# Altium project DC_Handle_Master.PrjPcb
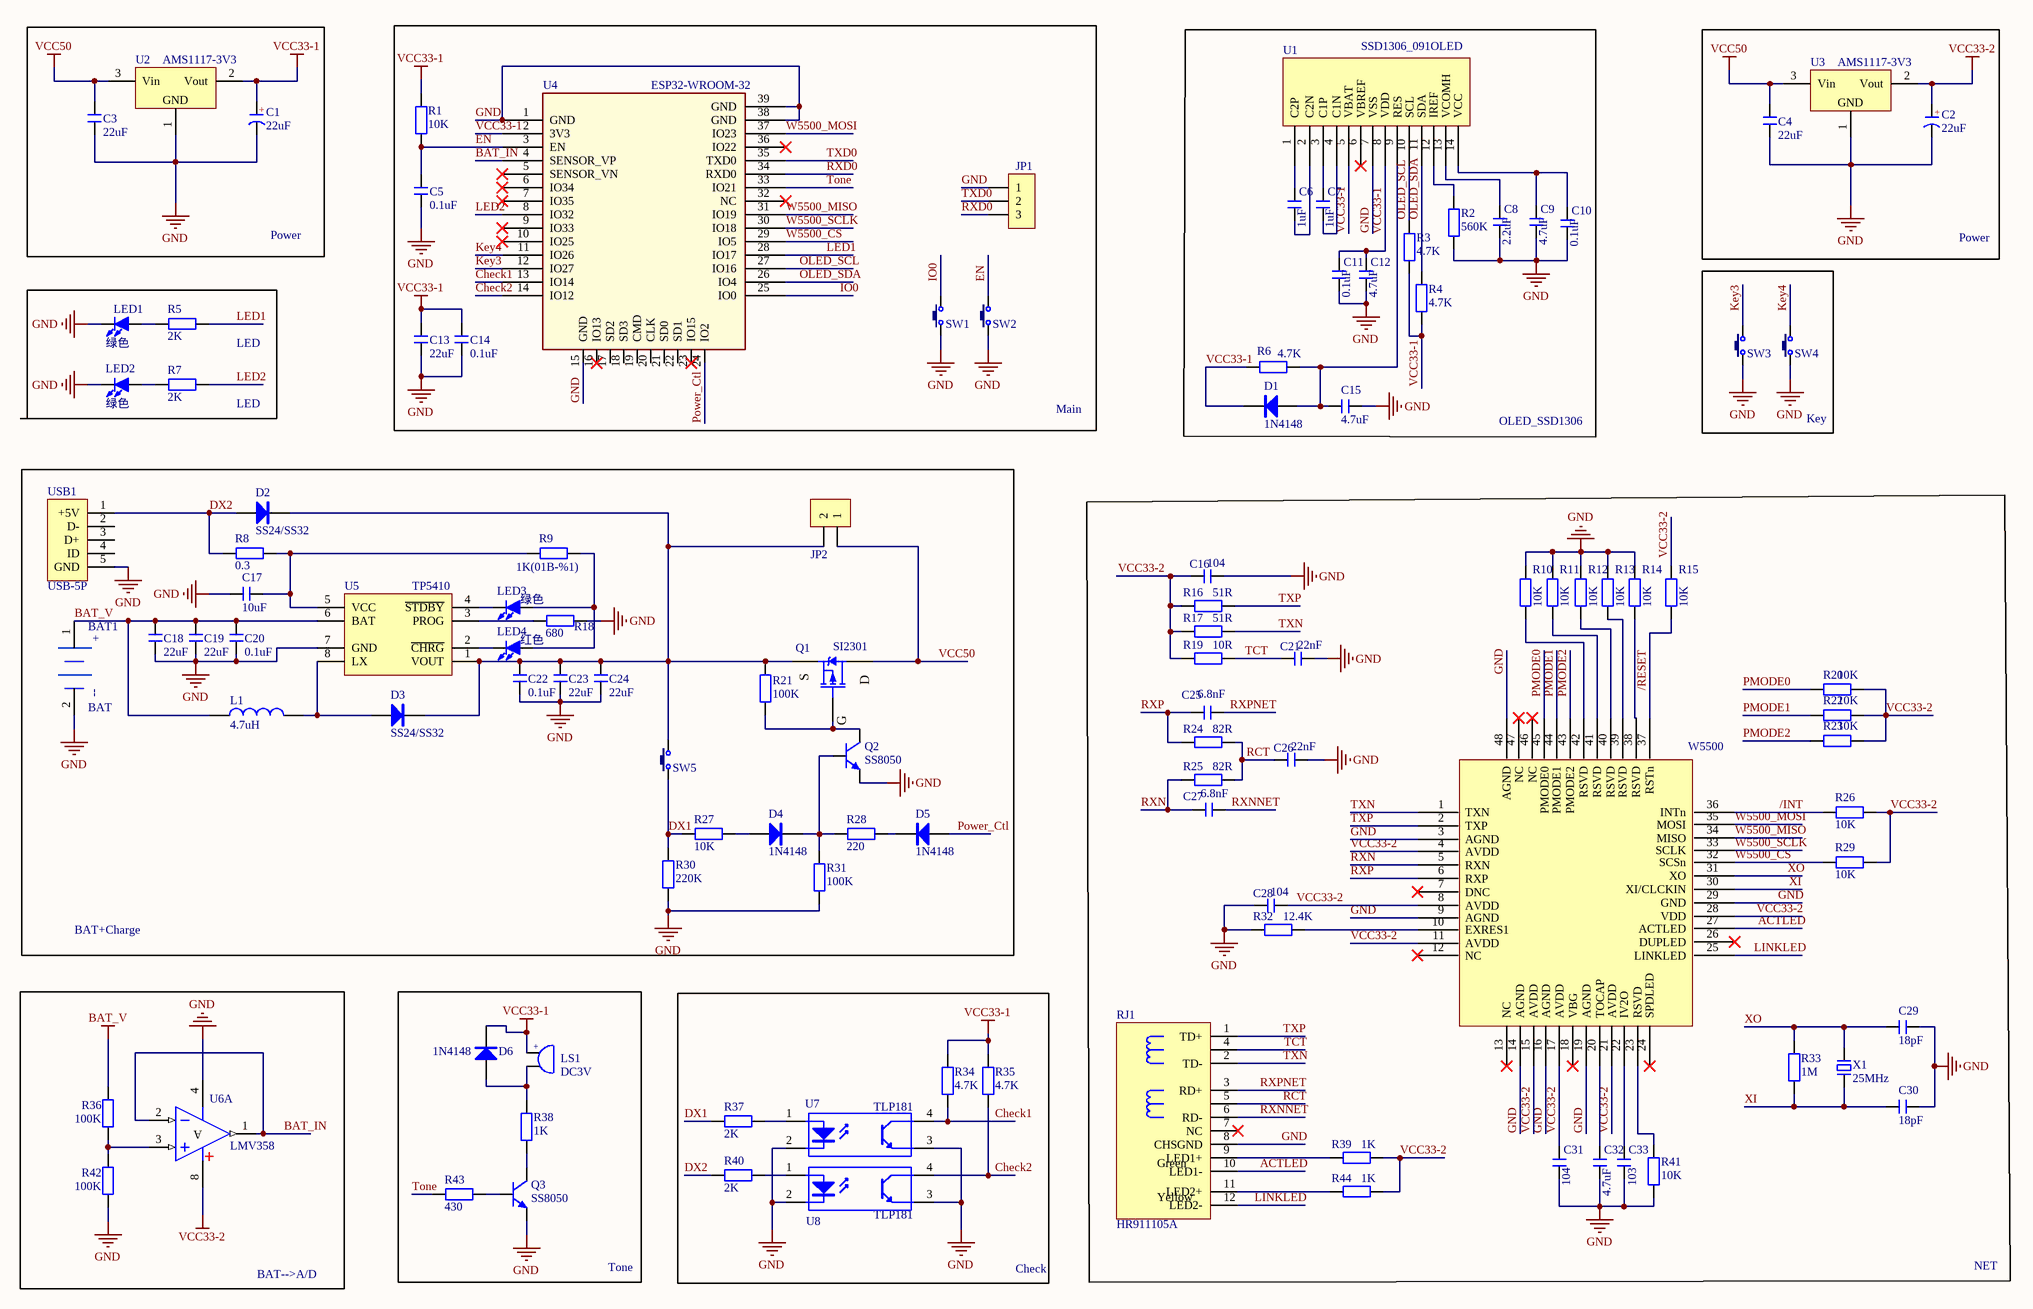
[diagram p0: DC_Handle_Master.SchDoc]
1 sheet, 112 parts. Net scope: global (net labels, ports and power ports of the same name join across sheets).

## Sheet DC_Handle_Master.SchDoc
size A2

### Parts
?  W5500  [LQFP48 7X7_M]
BAT1  BAT  [MX 1.25-LS-2P]
C1  22uF  [CD A(3216)]
C2  22uF  [CD A(3216)]
C3  22uF  [C 0805_L]
C4  22uF  [C 0805_L]
C5  0.1uF  [C 0805_L]
C6  1uF  [C 0805_L]
C7  1uF  [C 0805_L]
C8  2.2uF  [C 0805_L]
C9  4.7uF  [C 0805_L]
C10  0.1uF  [C 0805_L]
C11  0.1uF  [C 0805_L]
C12  4.7uF  [C 0805_L]
C13  22uF  [C 0805_L]
C14  0.1uF  [C 0805_L]
C15  4.7uF  [C 0805_L]
C16  104  [C 0805_L]
C17  10uF  [C 0805_L]
C18  22uF  [C 0805_L]
C19  22uF  [C 0805_L]
C20  0.1uF  [C 0805_L]
C21  22nF  [C 0805_L]
C22  0.1uF  [C 0805_L]
C23  22uF  [C 0805_L]
C24  22uF  [C 0805_L]
C25  6.8nF  [C 0805_L]
C26  22nF  [C 0805_L]
C27  6.8nF  [C 0805_L]
C28  104  [C 0805_L]
C29  18pF  [C 0805_L]
C30  18pF  [C 0805_L]
C31  104  [C 0805_L]
C32  4.7uF  [C 0805_L]
C33  103  [C 0805_L]
D1  1N4148  [MINI_MELF (LL34)]
D2  SS24/SS32  [SMB]
D3  SS24/SS32  [SMB]
D4  1N4148  [MINI_MELF (LL34)]
D5  1N4148  [MINI_MELF (LL34)]
D6  1N4148  [MINI_MELF (LL34)]
JP1  HDR-1X3  [MX 1.25-LS-3P]  (value not drawn)
JP2  HDR-1X2  [HDR2.54-LI-2P]  (value not drawn)
L1  4.7uH  [NR5020]
LED1  绿色  [LED 0603G]
LED2  绿色  [LED 0603G]
LED3  绿色  [LED 0603G]
LED4  红色  [LED 0603R]
LS1  DC3V  [NR5020]
Q1  SI2301  [SOT23-3N]
Q2  SS8050  [SOT23-3N]
Q3  SS8050  [SOT23-3N]
R1  10K  [R 0603_L]
R2  560K  [R 0603_L]
R3  4.7K  [R 0603_L]
R4  4.7K  [R 0603_L]
R5  2K  [R 0603_L]
R6  4.7K  [R 0603_L]
R7  2K  [R 0603_L]
R8  0.3  [R 0805_M]
R9  1K(01B-%1)  [R 0805_L]
R10  10K  [R 0603_L]
R11  10K  [R 0603_L]
R12  10K  [R 0603_L]
R13  10K  [R 0603_L]
R14  10K  [R 0603_L]
R15  10K  [R 0603_L]
R16  51R  [R 0603_L]
R17  51R  [R 0603_L]
R18  680  [R 0805_L]
R19  10R  [R 0603_L]
R20  10K  [R 0603_L]
R21  100K  [R 0805_L]
R22  10K  [R 0603_L]
R23  10K  [R 0603_L]
R24  82R  [R 0603_L]
R25  82R  [R 0603_L]
R26  10K  [R 0603_L]
R27  10K  [R 1206_L]
R28  220  [R 0805_L]
R29  10K  [R 0603_L]
R30  220K  [R 1206_L]
R31  100K  [R 0805_L]
R32  12.4K  [R 0603_L]
R33  1M  [R 0603_L]
R34  4.7K  [R 0603_L]
R35  4.7K  [R 0603_L]
R36  100K  [R 0603_L]
R37  2K  [R 0603_L]
R38  1K  [R 0603_L]
R39  1K  [R 0603_L]
R40  2K  [R 0603_L]
R41  10K  [R 0603_L]
R42  100K  [R 0603_L]
R43  430  [R 0603_L]
R44  1K  [R 0603_L]
RJ1  HR911105A  [RJ-45A12]
SW1  3x6x5  [TSW SMD-3*6*2.5]  (value not drawn)
SW2  3x6x5  [TSW SMD-3*6*2.5]  (value not drawn)
SW3  3x6x5  [TSW 3*6*4.3-S-W]  (value not drawn)
SW4  3x6x5  [TSW 3*6*4.3-S-W]  (value not drawn)
SW5  3x6x5  [TSW 3*6*4.3-S-W]  (value not drawn)
U1  SSD1306_091OLED  [SSD1306_091OLED]
U2  AMS1117-3V3  [SOT223_M]
U3  AMS1117-3V3  [SOT223_M]
U4  ESP32-WROOM-32  [ESP32-WROOM-32]
U5  TP5410  [ESOP8_M]
U6  LMV358  [SOP8_M]  (part A of 2)
U7  TLP181  [SOP4_M]
U8  TLP181  [SOP4_M]
USB1  USB-5P  [USB-MICRO_E]
X1  25MHz  [OSC HC-49S]

### Blocks framed on the sheet
Power: C1 C3 U2
Main: C5 C13 C14 JP1 R1 SW1 SW2 U4
OLED_SSD1306: C6-C12 C15 D1 R2-R4 R6 U1
Power: C2 C4 U3
Key: SW3 SW4
BAT+Charge: BAT1 C17-C20 C22-C24 D2-D5 JP2 L1 LED3 LED4 Q1 Q2 R8 R9 R18 R21 R27 R28 R30 R31 SW5 U5 USB1
NET: ? C16 C21 C25-C33 R10-R17 R19 R20 R22-R26 R29 R32 R33 R39 R41 R44 RJ1 X1
BAT-->A/D: R36 R42 U6
Tone: D6 LS1 Q3 R38 R43
Check: R34 R35 R37 R40 U7 U8

### Nets
BAT_V: BAT1.1(+) C18.1 C19.1 C20.1 L1.1 R36.1 U5.6(BAT)
GND: ?.3(AGND) ?.9(AGND) ?.14(AGND) ?.16(AGND) ?.19(AGND) ?.29(GND) ?.48(AGND) BAT1.2(-) C1.2(K) C2.2(K) C3.1 C4.1 C5.1 C8.1 C9.1 C10.1 C11.1 C12.1 C13.1 C14.1 C15.1 C16.2 C17.1 C18.2 C19.2 C20.2 C21.2 C22.2 C23.2 C24.2 C26.2 C28.1 C29.2 C30.2 C31.1 C32.1 C33.1 JP1.1 LED1.2(K) LED2.2(K) Q2.2(E) Q3.2(E) R2.2 R10.1 R11.1 R12.1 R13.1 R14.1 R18.2 R30.2 R31.2 R32.2 R41.2 R42.2 RJ1.8(CHSGND) SW1.1 SW2.1 SW3.1 SW4.1 U1.7(VSS) U2.1(GND) U3.1(GND) U4.1(GND) U4.15(GND) U4.38(GND) U4.39(GND) U5.7(GND) U6.4(V-) U7.2(K) U7.3(E) U8.2(K) U8.3(E) USB1.5(GND)
VCC33-1: C1.1(A) C11.2 C12.2 C13.2 C14.2 D1.2(K) D6.2(K) LS1.1 R1.2 R3.2 R4.2 R6.2 R34.1 R35.1 U1.5(VBAT) U1.8(VDD) U2.2(Vout) U4.2(3V3)
VCC33-2: ?.4(AVDD) ?.8(AVDD) ?.11(AVDD) ?.15(AVDD) ?.17(AVDD) ?.21(AVDD) ?.28(VDD) C2.1(A) C16.1 C28.2 C31.2 R15.1 R16.2 R17.2 R19.2 R20.1 R22.1 R23.1 R26.1 R29.1 R39.1 R44.1 U3.2(Vout) U6.8(V+)
VCC50: C3.2 C4.2 JP2.1 Q1.3(D) U2.3(Vin) U3.3(Vin)
/INT: ?.36(INTn) R26.2
/RESET: ?.37(RSTn) R15.2
ACTLED: ?.27(ACTLED) RJ1.10(LED1-)
BAT_IN: U4.4(SENSOR_VP) U6.1(OUT) U6.2(IN-)
Check1: R34.2 U4.13(IO14) U7.4(C)
Check2: R35.2 U4.14(IO12) U8.4(C)
DX1: R27.2 R30.1 R37.2 SW5.1
DX2: D2.1(A) R8.2 R40.2 USB1.1(+5V)
EN: C5.2 R1.1 SW2.2 U4.3(EN)
IO0: SW1.2 U4.25(IO0)
Key3: SW3.2 U4.12(IO27)
Key4: SW4.2 U4.11(IO26)
LED1: R5.2 U4.28(IO17)
LED2: R7.2 U4.8(IO32)
LINKLED: ?.25(LINKLED) RJ1.12(LED2-)
OLED_SCL: R3.1 U1.10(SCL) U4.27(IO16)
OLED_SDA: R4.1 U1.11(SDA) U4.26(IO4)
PMODE0: ?.45(PMODE0) R20.2
PMODE1: ?.44(PMODE1) R22.2
PMODE2: ?.43(PMODE2) R23.2
Power_Ctl: D5.1(A) U4.24(IO2)
RCT: C26.1 R24.1 R25.1 RJ1.5
RXD0: JP1.3 U4.34(RXD0)
RXN: ?.5(RXN) C27.1 R25.2
RXNNET: C27.2 RJ1.6(RD-)
RXP: ?.6(RXP) C25.1 R24.2
RXPNET: C25.2 RJ1.3(RD+)
TCT: C21.1 R19.1 RJ1.4
Tone: R43.1 U4.33(IO21)
TXD0: JP1.2 U4.35(TXD0)
TXN: ?.1(TXN) R17.1 RJ1.2(TD-)
TXP: ?.2(TXP) R16.1 RJ1.1(TD+)
W5500_CS: ?.32(SCSn) R29.2 U4.29(IO5)
W5500_MISO: ?.34(MISO) U4.31(IO19)
W5500_MOSI: ?.35(MOSI) U4.37(IO23)
W5500_SCLK: ?.33(SCLK) U4.30(IO18)
XI: ?.30(XI/CLCKIN) C30.1 R33.2 X1.1
XO: ?.31(XO) C29.1 R33.1 X1.2
Net?_10: ?.10(EXRES1) R32.1
Net?_20: ?.20(TOCAP) C32.2
Net?_22: ?.22(IV2O) C33.2
Net?_23: ?.23(RSVD) R41.1
Net?_38: ?.38(RSVD) R14.2
Net?_39: ?.39(RSVD) R13.2
Net?_40: ?.40(RSVD) R12.2
Net?_41: ?.41(RSVD) R11.2
Net?_42: ?.42(RSVD) R10.2
NetC6_1: C6.1 U1.2(C2N)
NetC6_2: C6.2 U1.1(C2P)
NetC7_1: C7.1 U1.4(C1N)
NetC7_2: C7.2 U1.3(C1P)
NetC8_2: C8.2 U1.13(VCOMH)
NetC9_2: C9.2 C10.2 U1.14(VCC)
NetC15_2: C15.2 D1.1(A) R6.1 U1.9(RES)
NetC17_2: C17.2 R8.1 R9.2 U5.5(VCC)
NetC22_1: C22.1 C23.1 C24.1 D2.2(K) D3.2(K) JP2.2 Q1.2(S) R21.1 SW5.2 U5.1(VOUT)
NetD3_1: D3.1(A) L1.2 U5.8(LX)
NetD4_1: D4.1(A) R27.1
NetD4_2: D4.2(K) Q2.1(B) R28.2 R31.1
NetD5_2: D5.2(K) R28.1
NetD6_1: D6.1(A) LS1.2 R38.2
NetLED1_1: LED1.1(A) R5.1
NetLED2_1: LED2.1(A) R7.1
NetLED3_1: LED3.1(A) LED4.1(A) R9.1
NetLED3_2: LED3.2(K) U5.4(~{STDBY})
NetLED4_2: LED4.2(K) U5.2(~{CHRG})
NetQ1_1: Q1.1(G) Q2.3(C) R21.2
NetQ3_1: Q3.1(B) R43.2
NetQ3_3: Q3.3(C) R38.1
NetR2_1: R2.1 U1.12(IREF)
NetR18_1: R18.1 U5.3(PROG)
NetR36_2: R36.2 R42.1 U6.3(IN+)
NetR37_1: R37.1 U7.1(A)
NetR39_2: R39.2 RJ1.9(LED1+)
NetR40_1: R40.1 U8.1(A)
NetR44_2: R44.2 RJ1.11(LED2+)

Not connected (* = marked no-connect by the designer): ? 7(DNC)* 12(NC)* 13(NC)* 18(VBG)* 24(SPDLED)* 26(DUPLED)* 46(NC)* 47(NC)*; RJ1 7(NC)*; U1 6(VBREF)*; U4 5(SENSOR_VN)* 6(IO34)* 7(IO35)* 9(IO33)* 10(IO25)* 16(IO13)* 17(SD2) 18(SD3) 19(CMD) 20(CLK) 21(SD0) 22(SD1) 23(IO15)* 32(NC)* 36(IO22)*; USB1 2(D-) 3(D+) 4(ID)

### Notes on the sheet
- LED
- (near R7) LED
- (in symbol BAT) --
- (in symbol BEEP) +
- (in symbol C-CD) +
- (in symbol HR911105A) Green; Yellow
- (in symbol LM358, part A) A

### Library data of the parts
C1 C2 = C-CD: 贴片钽电容; 版权归属: 源创客; BOM名称: 贴片钽电容; 学习资源: www.ooocke.com
C3-C33 = C: 无极性贴片电容; 版权归属: 源创客; BOM名称: 无极性贴片电容; 学习资源: www.ooocke.com
D1 D4-D6 = 1N4148: 高速开关二极管; 版权归属: 源创客; BOM名称: 高速开关二极管; 学习资源: www.ooocke.com
D2 D3 = SS24: 肖特基二极管; 版权归属: 源创客; 属性: 40V/2A; BOM名称: 肖特基二极管; 学习资源: www.ooocke.com
JP1 = Header 3: 3P接插件; 版权归属: 源创客; BOM名称: 3P接插件; 学习资源: www.ooocke.com
JP2 = Header 2: 2P接插件; 版权归属: 源创客; BOM名称: 2P接插件; 学习资源: www.ooocke.com
L1 = L: 小功率贴片电感; 版权归属: 源创客; BOM名称: 小功率贴片电感; 学习资源: www.ooocke.com
LED1 LED2 = LED-3MM: 插件LED; 版权归属: 源创客; BOM名称: 插件LED; 学习资源: www.ooocke.com
LED3 LED4 = LED-SMD: 贴片LED; 版权归属: 源创客; BOM名称: 贴片LED; 学习资源: www.ooocke.com
LS1 = BEEP: 蜂鸣器; 版权归属: 源创客; BOM名称: 蜂鸣器; 学习资源: www.ooocke.com
Q1 = SI2301: P沟道场效应管; 版权归属: 源创客; BOM名称: P沟道场效应管; 学习资源: www.ooocke.com
Q2 Q3 = 8050-SMD: 高频放大-NPN型; 版权归属: 源创客; 属性: 40V 1.5A 1W 100MHZ; BOM名称: 高频放大-NPN型; 学习资源: www.ooocke.com
R1-R44 = R: 贴片电阻; 版权归属: 源创客; BOM名称: 贴片电阻; 学习资源: www.ooocke.com
RJ1 = HR911105A: 带灯以太网接口; 版权归属: 源创客; BOM名称: 带灯以太网接口; 学习资源: www.ooocke.com
SW1-SW5 = TSW 3x6: 3x6轻触开关; 版权归属: 源创客; BOM名称: 3x6轻触开关; 学习资源: www.ooocke.com
U2 U3 = AMS1117: 三端稳压芯片; BOM名称: 稳压芯片; 版权归属: 源创客; 学习资源: www.ooocke.com
U6 = LM358: 双路运放; 版权归属: 源创客; BOM名称: 双路运放; 学习资源: www.ooocke.com
U7 U8 = TLP181: 光耦; 版权归属: 源创客; BOM名称: 光耦; 学习资源: www.ooocke.com
USB1 = USB-5P: 微型USB母座; 版权归属: 源创客; BOM名称: 微型USB母座; 学习资源: www.ooocke.com
X1 = XTAL-2P: 2脚无源脚晶振; 版权归属: 源创客; BOM名称: 2脚无源脚晶振; 学习资源: www.ooocke.com